# EAGLE schematic batteryBalancer (EAGLE 8.0.0)
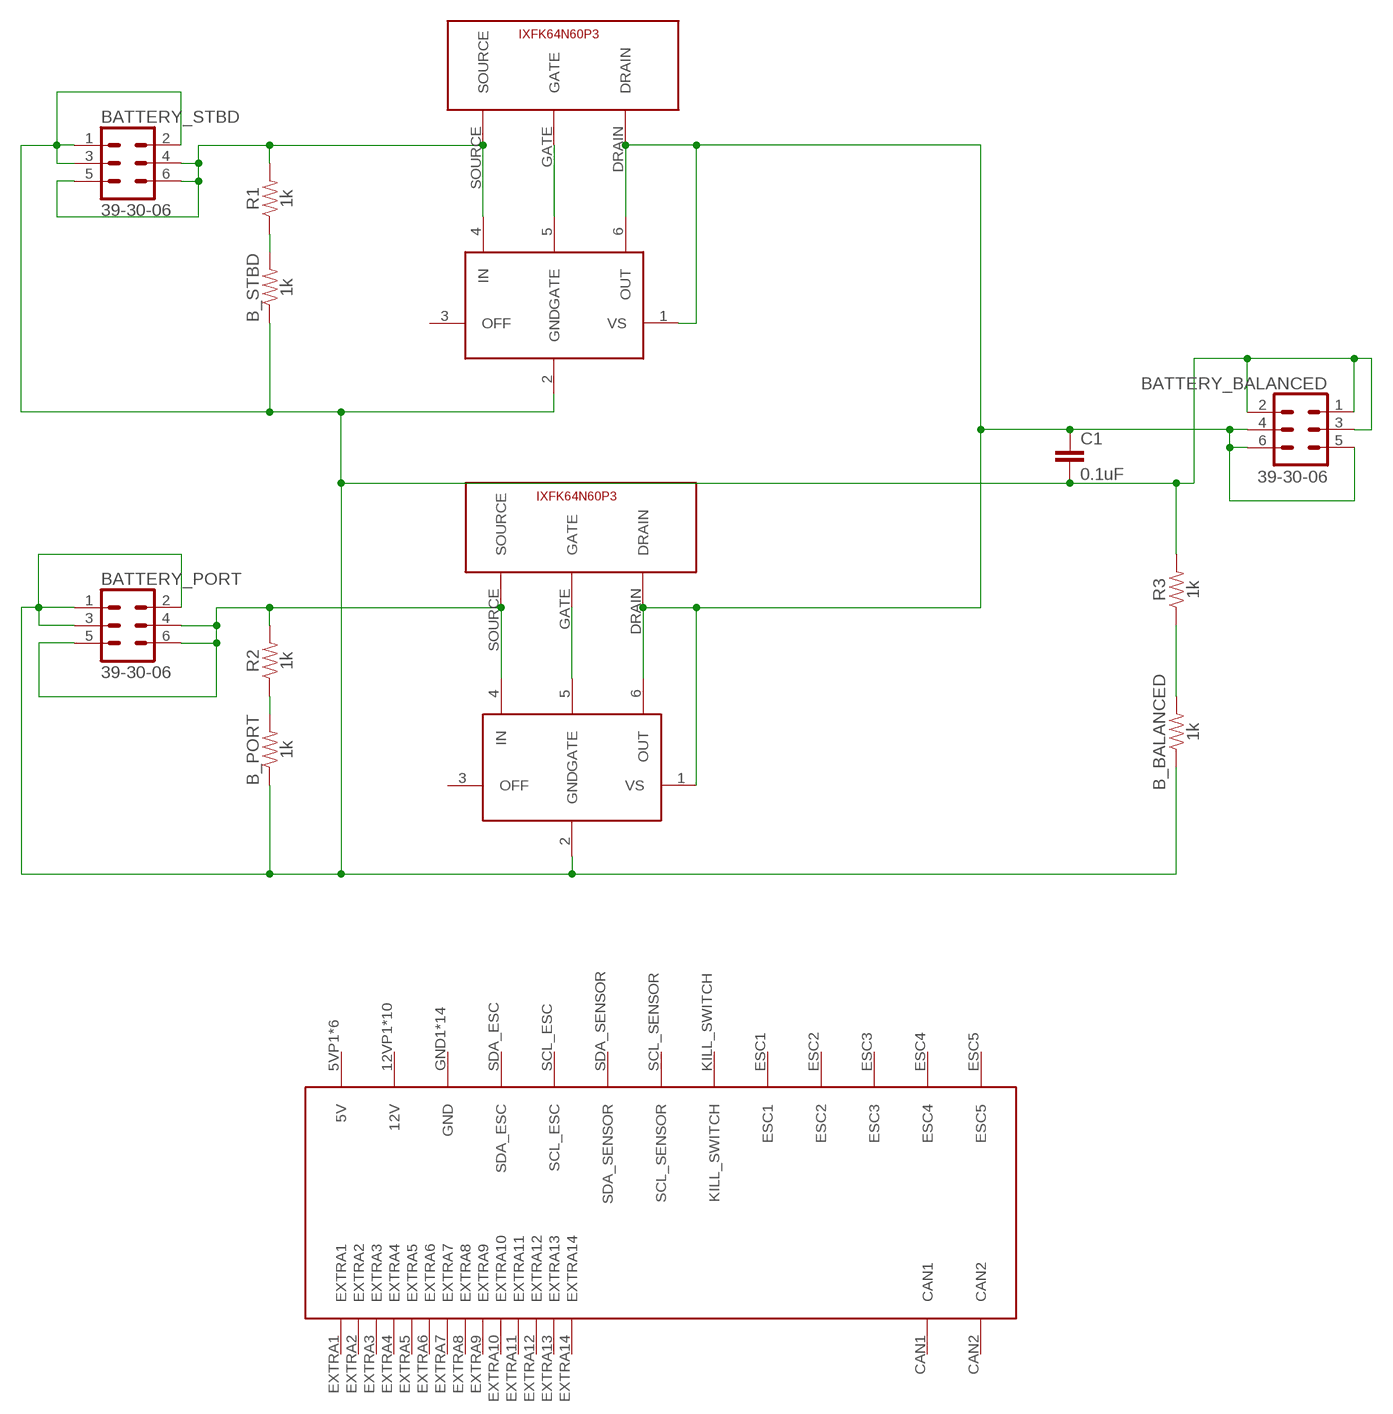
[diagram p0: schematic, sheet 1]

## Parts
B_BALANCED  1k  1KOHM-HORIZ_KIT-1/4W-5%  [AXIAL-0.3-KIT]
B_PORT  1k  1KOHM-HORIZ_KIT-1/4W-5%  [AXIAL-0.3-KIT]
B_STBD  1k  1KOHM-HORIZ_KIT-1/4W-5%  [AXIAL-0.3-KIT]
BATTERY_BALANCED  39-30-06  [39-30-?06?]
BATTERY_PORT  39-30-06  [39-30-?06?]
BATTERY_STBD  39-30-06  [39-30-?06?]
C1  0.1uF  0.1UF-KIT-EZ-50V-20%  [CAP-PTH-SMALL-KIT]
MOS_PORT  IXFK64N60P3  [IXFK64N60P3]
MOS_STBD  IXFK64N60P3  [IXFK64N60P3]
R1  1k  1KOHM-HORIZ_KIT-1/4W-5%  [AXIAL-0.3-KIT]
R2  1k  1KOHM-HORIZ_KIT-1/4W-5%  [AXIAL-0.3-KIT]
R3  1k  1KOHM-HORIZ_KIT-1/4W-5%  [AXIAL-0.3-KIT]
U$3  LM5050-1  [SOT23-6]
U$4  LM5050-1  [SOT23-6]
U$5  5530843  [5530843-6-BOARDFINGERS]

## Nets
BALENCED_LOAD: BATTERY_BALANCED.4 BATTERY_BALANCED.5 BATTERY_BALANCED.6 C1.1 MOS_PORT.DRAIN MOS_STBD.DRAIN U$3.1(VS) U$3.6(OUT) U$4.1(VS) U$4.6(OUT)
BAT_GND: B_BALANCED.P$1 B_PORT.P$1 B_STBD.P$1 BATTERY_BALANCED.1 BATTERY_BALANCED.2 BATTERY_BALANCED.3 BATTERY_PORT.1 BATTERY_PORT.2 BATTERY_PORT.3 BATTERY_STBD.1 BATTERY_STBD.2 BATTERY_STBD.3 C1.2 R3.P$2 U$3.2(GND) U$4.2(GND)
GATE1: MOS_STBD.GATE U$3.5(GATE)
GATE2: MOS_PORT.GATE U$4.5(GATE)
LOAD_1: BATTERY_STBD.4 BATTERY_STBD.5 BATTERY_STBD.6 MOS_STBD.SOURCE R1.P$2 U$3.4(IN)
LOAD_2: BATTERY_PORT.4 BATTERY_PORT.5 BATTERY_PORT.6 MOS_PORT.SOURCE R2.P$2 U$4.4(IN)
N$2: B_BALANCED.P$2 R3.P$1
N$3: B_STBD.P$2 R1.P$1
N$4: B_PORT.P$2 R2.P$1
Unconnected: U$3.3(OFF) U$4.3(OFF) U$5.5VP1(5V) U$5.5VP2(5V) U$5.5VP3(5V) U$5.5VP4(5V) U$5.5VP5(5V) U$5.5VP6(5V) U$5.12VP1(12V) U$5.12VP2(12V) U$5.12VP3(12V) U$5.12VP4(12V) U$5.12VP5(12V) U$5.12VP6(12V) U$5.12VP7(12V) U$5.12VP8(12V) U$5.12VP9(12V) U$5.12VP10(12V) U$5.CAN1 U$5.CAN2 U$5.ESC1 U$5.ESC2 U$5.ESC3 U$5.ESC4 U$5.ESC5 U$5.EXTRA1 U$5.EXTRA2 U$5.EXTRA3 U$5.EXTRA4 U$5.EXTRA5 U$5.EXTRA6 U$5.EXTRA7 U$5.EXTRA8 U$5.EXTRA9 U$5.EXTRA10 U$5.EXTRA11 U$5.EXTRA12 U$5.EXTRA13 U$5.EXTRA14 U$5.GND1(GND) U$5.GND2(GND) U$5.GND3(GND) U$5.GND4(GND) U$5.GND5(GND) U$5.GND6(GND) U$5.GND7(GND) U$5.GND8(GND) U$5.GND9(GND) U$5.GND10(GND) U$5.GND11(GND) U$5.GND12(GND) U$5.GND13(GND) U$5.GND14(GND) U$5.KILL_SWITCH U$5.SCL_ESC U$5.SCL_SENSOR U$5.SDA_ESC U$5.SDA_SENSOR

## Library data of the parts
B_BALANCED B_PORT B_STBD R1-R3 = SparkFun-Resistors:1KOHM: 1kΩ resistor A resistor is a passive two-terminal electrical component that implements electrical resistance as a circuit element. Resistors act to reduce current flow, and, at the same time, act to lower voltage levels within circuits. - Wikipedia; PROD_ID: RES-08380
BATTERY_BALANCED BATTERY_PORT BATTERY_STBD = con-molex-mini-fit:39-30-?06?: HEADER
C1 = SparkFun-Capacitors:0.1UF: 0.1µF ceramic capacitors A capacitor is a passive two-terminal electrical component used to store electrical energy temporarily in an electric field.; PROD_ID: CAP-08370
MOS_PORT MOS_STBD = IXFK64N60P3:IXFK64N60P3
U$3 U$4 = lio:LM5050-1
U$5 = 5530843-6:5530843: TE-CONNECTIVITY 5530843 EDGE CONNECTOR